# Altium schematic sheet 2022_AESK_UAV_Power.SchDoc: =ProjectName
size A4; Organization: AESK; Address1: Designed by:; Address3: FATİH CAN; Revision: 2022 v1; SheetNumber: 3; SheetTotal: 6; ImagePath: AMBLEM.bmp
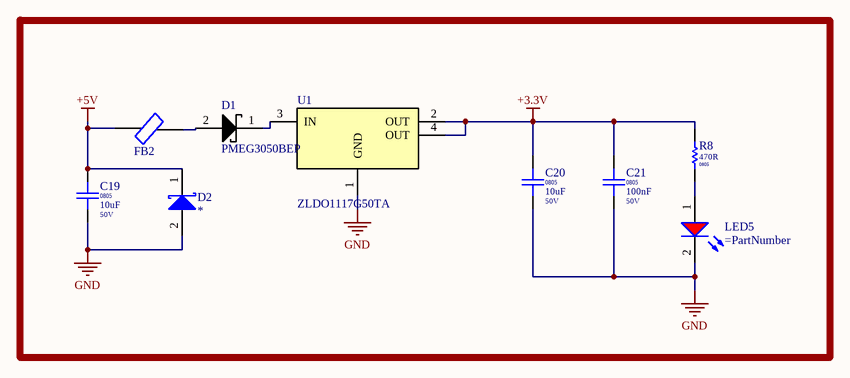
[diagram p0: 2022_AESK_UAV_Power.SchDoc]

## Parts
C19  Package / Case: 0805  Voltage: 50V  [CAPC 0805]  (hidden comment: 10uF)
C20  Package / Case: 0805  Voltage: 50V  [CAPC 0805]  (hidden comment: 10uF)
C21  Package / Case: 0805  Voltage: 50V  [CAPC 0805]  (hidden comment: 100nF)
D1  PMEG3050BEP  [SOD470X100-2N]
D2  *  [DO-214AC, SMA]
FB2  Ferrite Bead  [FCM1608KF-601T03]  (value not drawn)
LED5  (no value)  [LED RED 0805]
R8  Package / Case: 0805  [RESC 0805]  (hidden comment: 470R)
U1  ZLDO1117G50TA  [1117]

## Nets
+3.3V: C20.2 C21.2 R8.2 U1.2(OUT) U1.4(OUT)
+5V: C19.2 D2.1(K) FB2.2
GND: C19.1 C20.1 C21.1 D2.2(A) LED5.2(C) U1.1(GND)
NetD1_1: D1.1(K) U1.3(IN)
NetD1_2: D1.2(A) FB2.1
NetLED5_1: LED5.1(A) R8.1

## Notes on the sheet
- Title
- Size:
- Date:
- A4
- Number:
- Time:
- Revision:
- Sheet
- of
- File:

## Library data of the parts
C19 C20 = CAPC0588: Capacitor Ceramic 10uF 50V 0805; Value Rating: uF; Value: 10uF; Part Number: CAPC0588; Category: Capacitor Ceramic; Values: 10uF 50V
C21 = CAPC0572: Capacitor Ceramic 100nF 50V 0805; Value Rating: nF; Favorites: Favorite; Value: 100nF; Part Number: CAPC0572; Category: Capacitor Ceramic; Values: 100nF 50V
D1 = Schotky Diode: Manufacturer: Nexperia USA; Manufacturer Part Number: PMEG3050BEP,115; Supplier 1: Digi-Key; Supplier Part Number 1: 1727-5207-1-ND; Stock 1: 62590; Pricing 1: 1=0.44, 10=0.373, 100=0.2786, 500=0.2189, 1000=0.1692 (USD)
D2 = Diode0012: Values: FILL!!!; Diode Type: Schottky; Manufacturer Part Number: *; Part Number: Diode0012; Category: Diode Schottky; Package / Case: DO-214AC, SMA; Voltage - DC Reverse (Vr): FILL!!!; Voltage - Forward (Vf): FILL!!!; Current: FILL!!!; Speed: FILL!!!
FB2 = FCM1608KF-601T03
LED5 = LED RED: LED
R8 = R0334: 470R 0805; Part Number: R0334; Value: 470R; Category: Resistor; Values: 470R
U1 = ZLDO1117G50TA: IC REG LDO 5V 1A SOT223